# EAGLE design picospeaker (EAGLE 9.6.2)
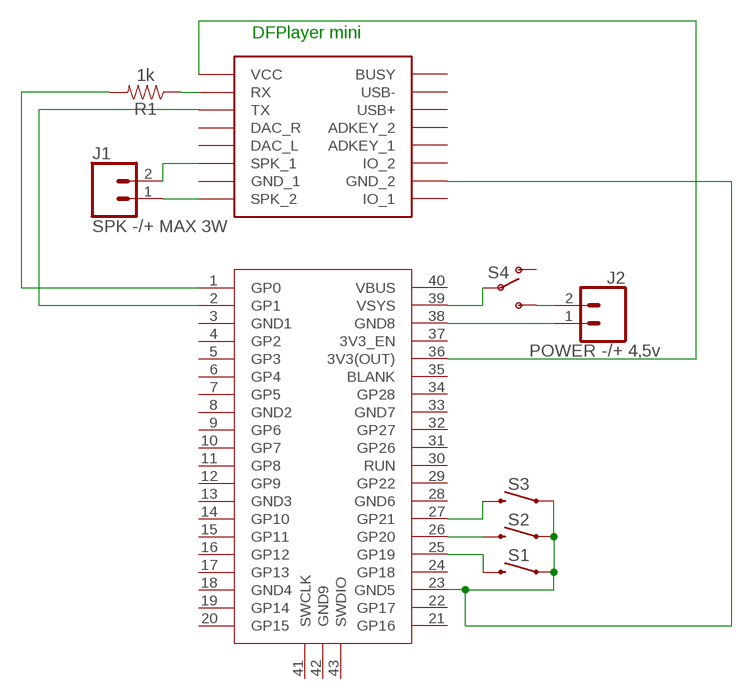
[diagram p0: schematic, sheet 1]

## Parts
J1  SPK -/+ MAX 3W  CONN_02  [1X02]
J2  POWER -/+ 4,5v  CONN_02  [1X02]
R1  1k  1KOHM-HORIZ_KIT-1/4W-5%  [AXIAL-0.3-KIT]
S1  MOMENTARY-SWITCH-SPST-PTH-6.0MM-KIT  [TACTILE_SWITCH_PTH_6.0MM_KIT]
S2  MOMENTARY-SWITCH-SPST-PTH-6.0MM-KIT  [TACTILE_SWITCH_PTH_6.0MM_KIT]
S3  MOMENTARY-SWITCH-SPST-PTH-6.0MM-KIT  [TACTILE_SWITCH_PTH_6.0MM_KIT]
S4  SWITCH-SPDTSMD  [SWITCH_SPDT_SMD]
U$1  RASPBERRY-PI-PICO  [PICO-PKG-TH]
U$2  DFPLAYER  [DFPLAYER]

## Nets
N$1: R1.P$1 U$2.RX
N$2: S3.3 U$1.27(GP21)
N$3: U$1.36(3V3(OUT)) U$2.VCC
N$4: J1.2 U$2.SPK1(SPK_1)
N$5: J1.1 U$2.SPK2(SPK_2)
N$6: R1.P$2 U$1.1(GP0)
N$7: U$1.2(GP1) U$2.TX
N$8: S1.1 S2.1 S3.1 U$1.23(GND5) U$2.GND_2
N$9: S2.3 U$1.26(GP20)
N$10: S1.3 U$1.25(GP19)
N$11: S4.2(P) U$1.39(VSYS)
N$12: J2.2 S4.3(S)
N$13: J2.1 U$1.38(GND8)
Unconnected: S4.1(O) U$1.4(GP2) U$1.5(GP3) U$1.6(GP4) U$1.7(GP5) U$1.9(GP6) U$1.10(GP7) U$1.11(GP8) U$1.12(GP9) U$1.14(GP10) U$1.15(GP11) U$1.16(GP12) U$1.17(GP13) U$1.19(GP14) U$1.20(GP15) U$1.21(GP16) U$1.22(GP17) U$1.24(GP18) U$1.29(GP22) U$1.30(RUN) U$1.31(GP26) U$1.32(GP27) U$1.34(GP28) U$1.35(BLANK) U$1.37(3V3_EN) U$1.41(SWCLK) U$1.43(SWDIO) U$2.ADKEY1(ADKEY_1) U$2.ADKEY2(ADKEY_2) U$2.BUSY U$2.DAC_L U$2.DAC_R U$2.GND_1 U$2.IO1(IO_1) U$2.IO2(IO_2) U$2.USB+ U$2.USB-

## Notes on the sheet
- DFPlayer mini

## Power pins joined to a net without a drawn wire
GND1: U$1.3(GND1)
GND2: U$1.8(GND2)
GND3: U$1.13(GND3)
GND4: U$1.18(GND4)
GND6: U$1.28(GND6)
GND7: U$1.33(GND7)
GND9: U$1.42(GND9)
VBUS: U$1.40(VBUS)

## Library data of the parts
J1 J2 = SparkFun-Connectors:CONN_02: Multi connection point. Often used as Generic Header-pin footprint for 0.1 inch spaced/style header connections On any of the 0.1 inch spaced packages, you can populate with these: Break Away Headers - Straight <https://www.sparkfun.com/products/116> (PRT-00116) Break Away Male Headers - Right Angle <https://www.sparkfun.com/products/553> (PRT-00553) Female Headers <https://www.sparkfun.com/products/115> (PRT-00115) Break Away Headers - Machine Pin <https://www.sparkfun.com/products/117> (PRT-00117) Break Away Female Headers - Swiss Machine Pin <https://www.sparkfun.com/products/743> (PRT-00743) For SCREWTERMINALS and SPRING TERMINALS visit here: Screw Terimnals on SparkFun.com <https://www.sparkfun.com/search/results?term=Screw+Terminals> (5mm/3.5mm/2.54mm spacing) This device is also useful as a general connection point to wire up your design to another part of your project. Our various solder wires solder well into these plated through hole pads. Hook-Up Wire - Assortment (Stranded, 22 AWG) <https://www.sparkfun.com/products/11375> (PRT-11375) Hook-Up Wire - Assortment (Solid Core, 22 AWG) <https://www.sparkfun.com/products/11367> (PRT-11367) View the entire wire category on our website here <https://www.sparkfun.com/categories/141> Special notes: Molex polarized connector foot print use with: PRT-08233 with associated crimp pins and housings. 2.54_SCREWTERM for use with PRT-10571. 3.5mm Screw Terminal footprints for PRT-08084 5mm Screw Terminal footprints for use with PRT-08432
R1 = SparkFun-Resistors:1KOHM: 1kΩ resistor A resistor is a passive two-terminal electrical component that implements electrical resistance as a circuit element. Resistors act to reduce current flow, and, at the same time, act to lower voltage levels within circuits. - Wikipedia; PROD_ID: RES-08380
S1-S3 = SparkFun-Switches:MOMENTARY-SWITCH-SPST: Momentary Switch (Pushbutton) - SPST Normally-open (NO) SPST momentary switches (buttons, pushbuttons). Variants PTH-12MM - 12mm square, through-hole Momentary Pushbutton Switch - 12mm Square <https://www.sparkfun.com/products/9190> (COM-09190) PTH-6.0MM, PTH-6.0MM-KIT - 6.0mm square, through-hole Mini Pushbutton Switch <https://www.sparkfun.com/products/97> (COM-00097) KIT package intended for soldering kit's - only one side of pads' copper is exposed. PTH-RIGHT-ANGLE-KIT - Right-angle, through-hole Right Angle Tactile Button <https://www.sparkfun.com/products/10791> - Used on SparkFun BigTime Watch Kit <https://www.sparkfun.com/products/11734> SMD-12MM - 12mm square, surface-mount Tactile Button - SMD (12mm) <https://www.sparkfun.com/products/12993> (COM-12993) Used on SparkFun PicoBoard <https://www.sparkfun.com/products/11888> SMD-4.5MM - 4.5mm Square Trackball Switch Used on SparkFun Blackberry Trackballer Breakout <https://www.sparkfun.com/products/13169> SMD-4.6MMX2.8MM - 4.60mm x 2.80mm, surface mount Used on SparkFun Pro Micro - RP2040 <https://www.sparkfun.com/products/17717> SMD-5.2MM, SMD-5.2-REDUNDANT - 5.2mm square, surface-mount Mini Pushbutton Switch - SMD <https://www.sparkfun.com/products/8720> (COM-08720) Used on Arduino Pro Mini <https://www.sparkfun.com/products/11114> REDUNDANT package connects both switch circuits together SMD-6.0X3.5MM - 6.0 x 3.5mm, surface mount Momentary Reset Switch SMD <https://www.sparkfun.com/products/8229> (COM-08229) SMD-6.2MM-TALL - 6.2mm square, surface mount Tactile Button - SMD (6mm) <https://www.sparkfun.com/products/12992> Used on SparkFun Digital Sandbox <https://www.sparkfun.com/products/12651> SMD-RIGHT-ANGLE - Right-angle, surface mount Used on SparkFun Block for Intel® Edison - Arduino <https://www.sparkfun.com/products/13036>; PROD_ID: SWCH-08441; SF_SKU: COM-00097
S4 = SparkFun-Retired:SWITCH-SPDT: SPDT Switch Simple slide switch, Spark Fun Electronics SKU : COM-00102 DPDT SMT slide switch, AYZ0202, SWCH-08179
U$1 = Proper-Pico:RASPBERRY-PI-PICO
U$2 = DFPlayer_v1:DFPLAYER

## Board
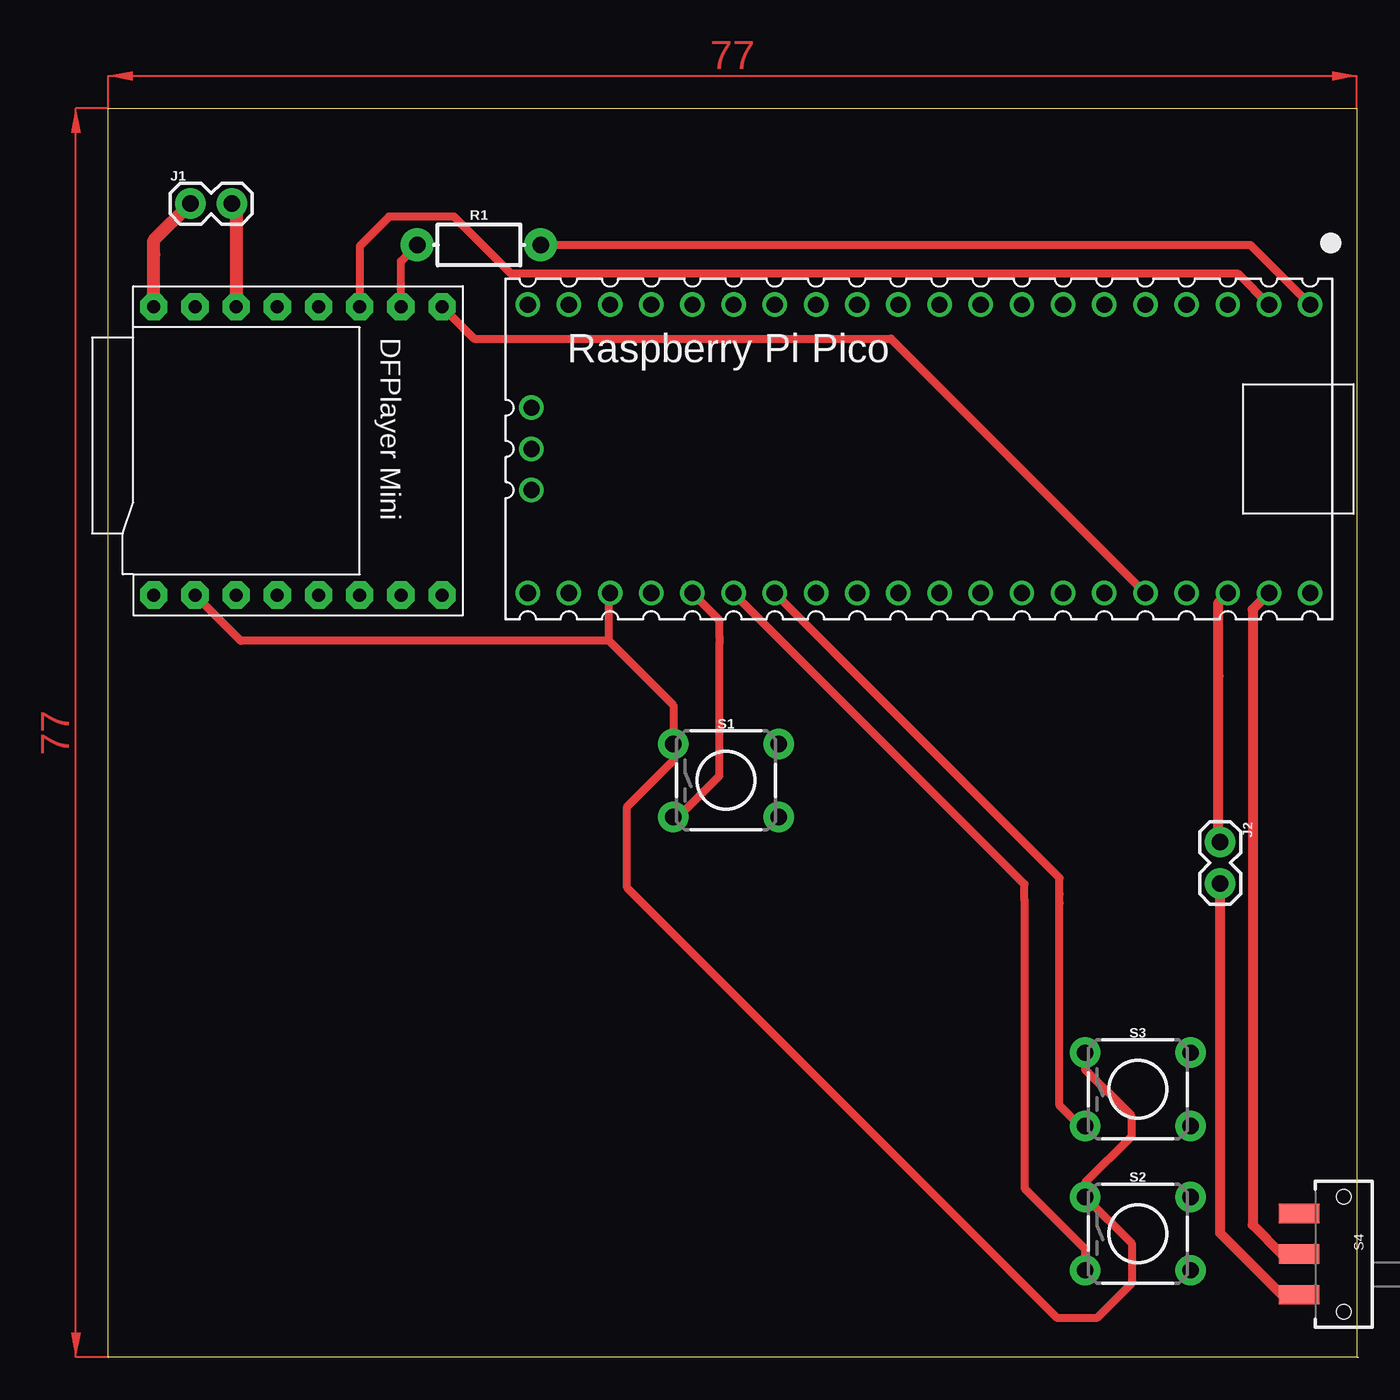
[diagram p1: board, top side]

Size 77.14 x 77 mm. Coordinates in mm from the lower left corner, seen from the top.
Outline: 77,0 77.14,0
Outline: 77,0 77,77 0,77 0,0 77,0
Copper layers (1*16): Top 0.035mm / dielectric 1.5mm / Bottom 0.035mm
Design rules "default *": minimum track width 20mil, minimum drill 0.35mm, track to track 15mil, track to pad 15mil, pad to pad 15mil, via to via 15mil, smd to smd 6mil, copper to edge 40mil, drill to drill 6mil, minimum pad ring 10mil, minimum via ring 8mil, stop-mask expansion 4mil, vias tented up to drill 0mil, thermal gap 10mil

### Footprints (pad centres in the part's own frame; a part is rotated, then mirrored left to right if it is on the bottom)
1X02 = drill 1.016 pad 1.88: 1 0,0; 2 2.54,0
AXIAL-0.3-KIT = drill 1.016 pad 2.032: P$1 -3.81,0; P$2 3.81,0
TACTILE_SWITCH_PTH_6.0MM_KIT = drill 1.016 pad 1.88: 1 -3.251,2.261; 2 3.251,2.261; 3 -3.251,-2.261; 4 3.251,-2.261
SWITCH_SPDT_SMD = smd 1.2 x 2.5: 1 -2.5,-2.75; 2 0,-2.75; 3 2.5,-2.75 | hole 0.9: -3.55,0; 3.55,0
PICO-PKG-TH = drill 1: 1 -8.89,24.13; 2 -8.89,21.59; 3 -8.89,19.05; 4 -8.89,16.51; 5 -8.89,13.97; 6 -8.89,11.43; 7 -8.89,8.89; 8 -8.89,6.35; 9 -8.89,3.81; 10 -8.89,1.27; 11 -8.89,-1.27; 12 -8.89,-3.81; 13 -8.89,-6.35; 14 -8.89,-8.89; 15 -8.89,-11.43; 16 -8.89,-13.97; 17 -8.89,-16.51; 18 -8.89,-19.05; 19 -8.89,-21.59; 20 -8.89,-24.13; 21 8.89,-24.13; 22 8.89,-21.59; 23 8.89,-19.05; 24 8.89,-16.51; 25 8.89,-13.97; 26 8.89,-11.43; 27 8.89,-8.89; 28 8.89,-6.35; 29 8.89,-3.81; 30 8.89,-1.27; 31 8.89,1.27; 32 8.89,3.81; 33 8.89,6.35; 34 8.89,8.89; 35 8.89,11.43; 36 8.89,13.97; 37 8.89,16.51; 38 8.89,19.05; 39 8.89,21.59; 40 8.89,24.13; 41 -2.54,-23.9; 42 0,-23.9; 43 2.54,-23.9
DFPLAYER = drill 0.8 pad 1.676 octagon: ADKEY1 8.89,-1.27; ADKEY2 8.89,1.27; BUSY 8.89,8.89; DAC_L -8.89,-1.27; DAC_R -8.89,1.27; GND_1 -8.89,-6.35; GND_2 8.89,-6.35; IO1 8.89,-8.89; IO2 8.89,-3.81; RX -8.89,6.35; SPK1 -8.89,-3.81; SPK2 -8.89,-8.89; TX -8.89,3.81; USB+ 8.89,3.81; USB- 8.89,6.35; VCC -8.89,8.89

### Placement (x,y rotation side)
J1  5.08,71.12 0 top
J2  68.58,31.75 270 top
R1  22.86,68.58 0 top
S1  38.1,35.56 0 top
S2  63.5,7.62 0 top
S3  63.5,16.51 0 top
S4  76.2,6.35 270 top
U$1  50,56 270 top
U$2  11.7,55.88 270 top

### Tracks (layer width: path | path; a pad name or v marks a point on that pad's centre or on a via)
N$1
  Top 0.508: U$2.RX 18.05,67.58 R1.P$1
N$2
  Top 0.508: S3.3 59.95,14.25 58.67,15.52 58.67,28 58.67,28.55 58.67,29.55 U$1.27
N$3
  Top 0.508: U$2.VCC 22.56,62.8 48.28,62.8 U$1.36
N$4
  Top 0.813: J1.2 7.89,70.85 U$2.SPK1
N$5
  Top 0.813: U$2.SPK2 2.81,68 2.81,68.85 J1.1
N$6
  Top 0.508: U$1.1 70.44,68.58 R1.P$2
N$7
  Top 0.508: U$2.TX 15.51,68.51 17.32,70.31 21.32,70.31 24.82,66.81 | 24.82,66.81 24.83,66.8 | 24.82,66.81 68,66.81 68.67,66.81 69.67,66.81 U$1.2
N$8
  Top 0.508: S3.1 60.25,17.75 63.09,14.9 63.09,13.6 60.25,10.75 S2.1 63.12,7.01 63.12,4.57 60.96,2.41 58.55,2.41 32,28.96 32,33.95 34.85,36.8 S1.1 34.85,40.19 30.87,44.17 | 30.87,44.17 8.17,44.17 U$2.GND_2 | 30.87,44.17 30.87,47.03 U$1.23
N$9
  Top 0.508: S2.3 60.25,6.69 56.52,10.43 56.52,28 56.52,28.16 56.52,29.16 U$1.26
N$10
  Top 0.508: S1.3 35.15,33.3 37.69,35.84 37.69,44 37.69,44.45 37.69,45.45 U$1.25
N$11
  Top 0.508: 72.39,6.35 S4.2
  Top 0.61: 72.39,6.35 70.59,8.15 70.59,46.11 U$1.39
N$12
  Top 0.508: 68.65,7.59 68.58,7.66 | 68.58,18
  Top 0.61: S4.3 72.39,3.85 68.65,7.59 | 68.58,24 68.58,20.51 68.58,20 68.58,18 68.58,7.66 | 68.58,24 J2.2 | 68.58,24
N$13
  Top 0.508: 68.48,31.85 J2.1 | 68.48,46.54 U$1.38
  Top 0.61: 68.48,31.85 68.48,42 68.48,46.54
(copper drawn outside any net)
  shapes: Top area x2